# Altium schematic sheet atuador_heater.SchDoc
size A4
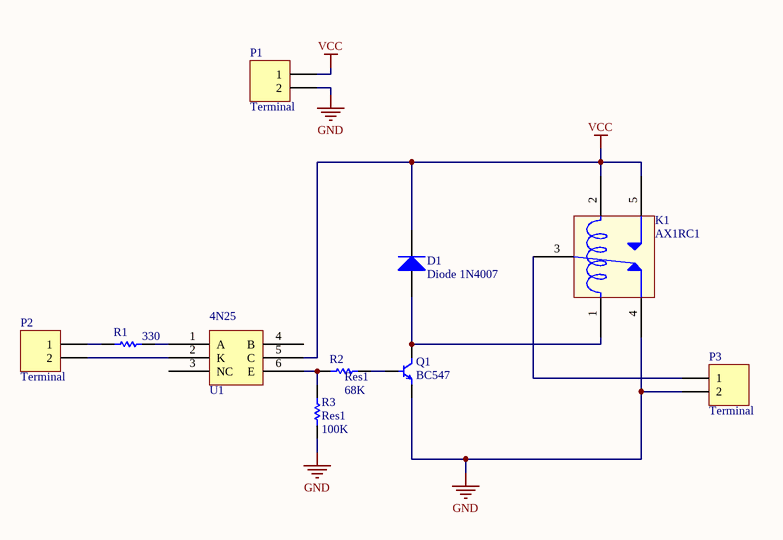
[diagram p0: atuador_heater.SchDoc]

## Parts
D1  Diode 1N4007  [DO-41]
K1  AX1RC1  [Relay-A]
P1  Terminal  [KRE_2]
P2  Terminal  [KRE_2]
P3  Terminal  [KRE_2]
Q1  BC547  [TO-92/CBE]
R1  value 330  [AXIAL-0.3]  (hidden comment: Res1)
R2  Res1  value 68K  [AXIAL-0.3]
R3  Res1  value 100K  [AXIAL-0.3]
U1  4N25  [4N25]

## Nets
GND: K1.4 P1.2 P3.2 Q1.E R3.1
VCC: D1.2(K) K1.2 K1.5 P1.1 U1.5(C)
NetD1_1: D1.1(A) K1.1 Q1.C
NetK1_3: K1.3 P3.1
NetP2_1: P2.1 R1.1
NetP2_2: P2.2 U1.2(K)
NetQ1_B: Q1.B R2.2
NetR1_2: R1.2 U1.1(A)
NetR2_1: R2.1 R3.2 U1.6(E)

Not connected (* = marked no-connect by the designer): U1 3(NC) 4(B)

## Library data of the parts
D1 = Diode 1N4007: 1 Amp General Purpose Rectifier; Published: 8-Jun-2000; LatestRevisionDate: 17-Jul-2002; LatestRevisionNote: Re-released for DXP Platform.; DatasheetVersion: 1998; PackageVersion: Aug-1999; PackageReference: DO-41; Publisher: Altium Limited; PackageDescription: Diode, Axial; Body 5.2 x 2.7 mm (LxDia. max), Lead Dia. 0.86 mm (max); Code_JEDEC: DO-204-AL; ComponentLink1Description: Manufacturer Link; ComponentLink1URL: http://www.fairchildsemi.com/; ComponentLink2Description: Datasheet; ComponentLink2URL: http://www.fairchildsemi.com/ds/1N%2F1N4001.pdf
K1 = AX1RC1: Miniature Relay, 15 A, 6 Vdc, 250 Vac; Maximum Switching Voltage (AC): 250 V; Maximum Switching Voltage (DC): 110 V; Maximum Switching Current: 15 A; Coil Nominal Voltage (DC): 6 V
P1-P3 = KRE_2: Terminal Block 1x2
Q1 = BC547: NPN Epitaxial Silicon Transistor; Complementary Part: BC557; Collector-Base Voltage (Vcb): 50 V; Collector-Emitter Voltage (Vce): 45 V; Emitter-Base Voltage (Veb): 6 V; Collector Current (Ic): 100 mA; Total Power Dissipation (Ptot): 500 mW; DC Current Gain Min (hfe): 110; DC Current Gain Max (hfe): 800; Transition Frequency (fT): 300 MHz
R1-R3 = Res1: Resistor; Published: 8-Jun-2000; LatestRevisionDate: 17-Jul-2002; LatestRevisionNote: Re-released for DXP Platform.; PackageReference: AXIAL-0.3; Publisher: Altium Limited; PackageDescription: Axial Device, Thru-Hole; 2 Leads; 0.3 in Pin Spacing